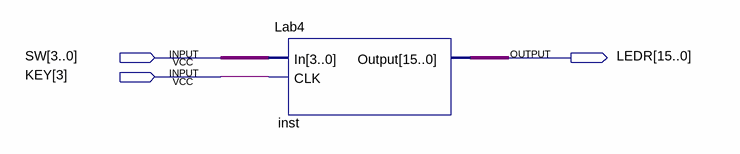
[diagram p0: schematic sheet]
// Quartus schematic Final_CPU_Design_For_KIT_DE2.bdf as structural Verilog: 1 symbols, 3 pins
module Final_CPU_Design_For_KIT_DE2 (
  input  [3:0] SW,
  input  [3:3] KEY,
  output [15:0] LEDR
);

  Lab4 inst (.In(SW), .CLK(KEY[3]), .Output(LEDR));
endmodule
